# EAGLE design intrinsicLED (EAGLE 9.6.2)
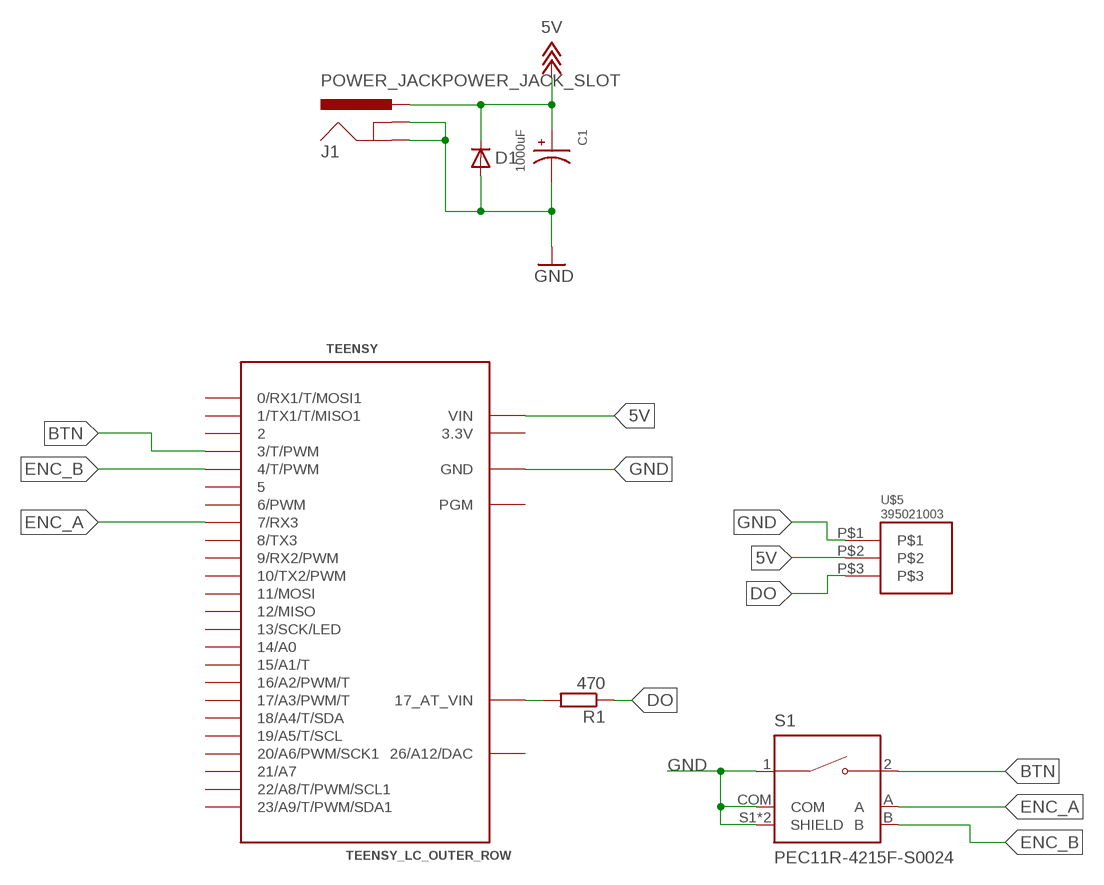
[diagram p0: schematic, sheet 1]

## Parts
C1  1000uF  16SVPF1000M  [CAP_16SVPF1000M]
D1  DIODE-DO214AA  [DO214AA]
J1  POWER_JACKPOWER_JACK_SLOT  [POWER_JACK_PTH_SLOT]
R1  470  R-EU_R1206  [R1206]
S1  PEC11R-4215F-S0024  [XDCR_PEC11R-4215F-S0024]
TEENSY  TEENSY_LC_OUTER_ROW  [TEENSY_3.0-3.2&LC_OUTER_ROW]
U$5  395021003  [395021003]

## Nets
5V: C1.1 D1.C J1.PWR TEENSY.VIN U$5.P$2 ; supply symbol labelled +18V
BTN: S1.2 TEENSY.3(3/T/PWM)
DO: R1.1 U$5.P$3
ENC_A: S1.A TEENSY.7(7/RX3)
ENC_B: S1.B TEENSY.4(4/T/PWM)
GND: C1.2 D1.A J1.GND J1.GNDBREAK S1.1 S1.COM S1.S1(SHIELD) S1.S2(SHIELD) TEENSY.AGND(GND) TEENSY.GND TEENSY.GND1(GND) U$5.P$1
N$1: R1.2 TEENSY.VBAT(17_AT_VIN)
Unconnected: TEENSY.0(0/RX1/T/MOSI1) TEENSY.1(1/TX1/T/MISO1) TEENSY.2 TEENSY.5 TEENSY.6(6/PWM) TEENSY.8(8/TX3) TEENSY.9(9/RX2/PWM) TEENSY.10(10/TX2/PWM) TEENSY.11(11/MOSI) TEENSY.12(12/MISO) TEENSY.13(13/SCK/LED) TEENSY.14/A0 TEENSY.15/A1(15/A1/T) TEENSY.16/A2(16/A2/PWM/T) TEENSY.17/A3(17/A3/PWM/T) TEENSY.18/A4(18/A4/T/SDA) TEENSY.19/A5(19/A5/T/SCL) TEENSY.20/A6(20/A6/PWM/SCK1) TEENSY.21/A7 TEENSY.22/A8(22/A8/T/PWM/SCL1) TEENSY.23/A9(23/A9/T/PWM/SDA1) TEENSY.PGM

## Power pins joined to a net without a drawn wire
3.3V: TEENSY.3.3V TEENSY.3.3V1(3.3V)
26/A12/DAC: TEENSY.RESET/DAC(26/A12/DAC)

## Library data of the parts
C1 = 16SVPF1000M:16SVPF1000M; DESCRIPTION: 1000F 16V Aluminum - Polymer Capacitors Radial, Can - SMD 12mOhm 5000 Hrs @ 105C; DIGI-KEY_PART_NUMBER: P16478TR-ND; MF: Panasonic; MP: 16SVPF1000M; PACKAGE: RADIAL-2 Panasonic; PURCHASE-URL: https://pricing.snapeda.com/search/part/16SVPF1000M/?ref=eda
D1 = diode:DIODE-: DIODE
J1 = SparkFun-Connectors:POWER_JACK: Power Jack Connector This is the standard 5.5mm barrel jack for power. The PTH is the most common, proven, reliable, footprint. The Slot footprint only works if the mill layer is transmitted to the PCB fab house so be warned. Here are the connectors we sell at SparkFun: DC Barrel Power Jack/Connector <https://www.sparkfun.com/products/119> (PRT-00119) DC Barrel Power Jack/Connector (SMD) <https://www.sparkfun.com/products/12748> (PRT-12748) DC Barrel Jack Adapter - Breadboard Compatible <https://www.sparkfun.com/products/10811> (PRT-10811) It is used on this SparkFun product (and many, many others): SparkFun RedBoard - Programmed with Arduino <https://www.sparkfun.com/products/12757> (DEV-12757) Also, if you need a mating power supply or connector, please check these out: Wall Adapter Power Supply - 9VDC 650mA <https://www.sparkfun.com/products/298> (TOL-00298) DC Barrel Jack Adapter - Male <https://www.sparkfun.com/products/10287> (PRT-10287); PROD_ID: CONN-08197
R1 = rcl:R-EU_: RESISTOR, European symbol; SPICEPREFIX: R
S1 = PEC11R-4215F-S0024:PEC11R-4215F-S0024: Incremental Encoder, 12 Mm, Contact Rating 10 Ma - 5 Vdc Check availability <https://pricing.snapeda.com/parts/PEC11R-4215F-S0024/Bourns/view-part?ref=eda>; AVAILABILITY: In Stock; DESCRIPTION: Rotary Encoder Mechanical 24 Quadrature (Incremental) Vertical; MF: Bourns; MP: PEC11R-4215F-S0024; PACKAGE: None; PRICE: None; PURCHASE-URL: https://pricing.snapeda.com/search/part/PEC11R-4215F-S0024/?ref=eda
TEENSY = Teensy_3_and_LC_Series_Boards_v1.4:TEENSY_LC_OUTER_ROW: Teensy LC with only outer row of pins.
U$5 = molex:395021003

## Board
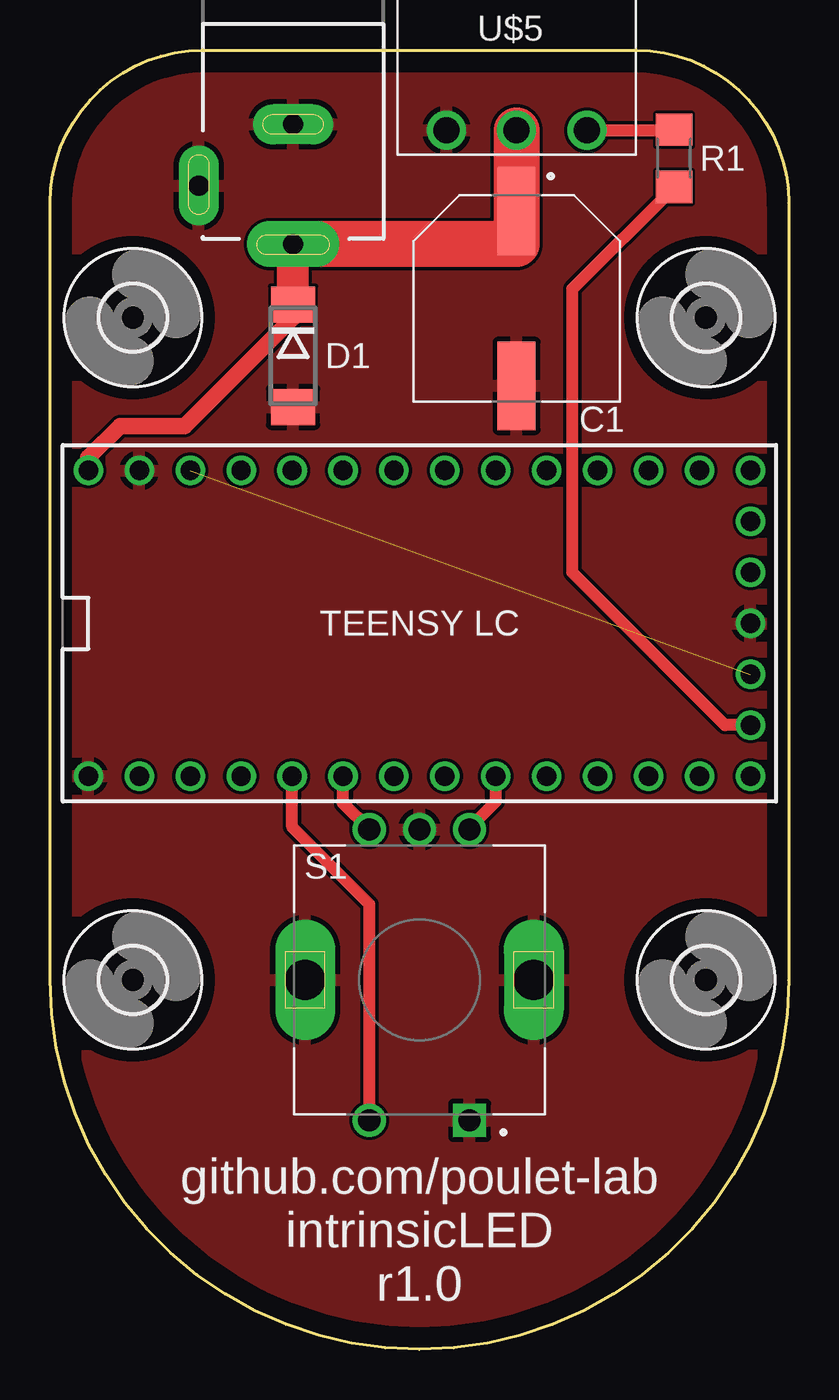
[diagram p1: board, top side]
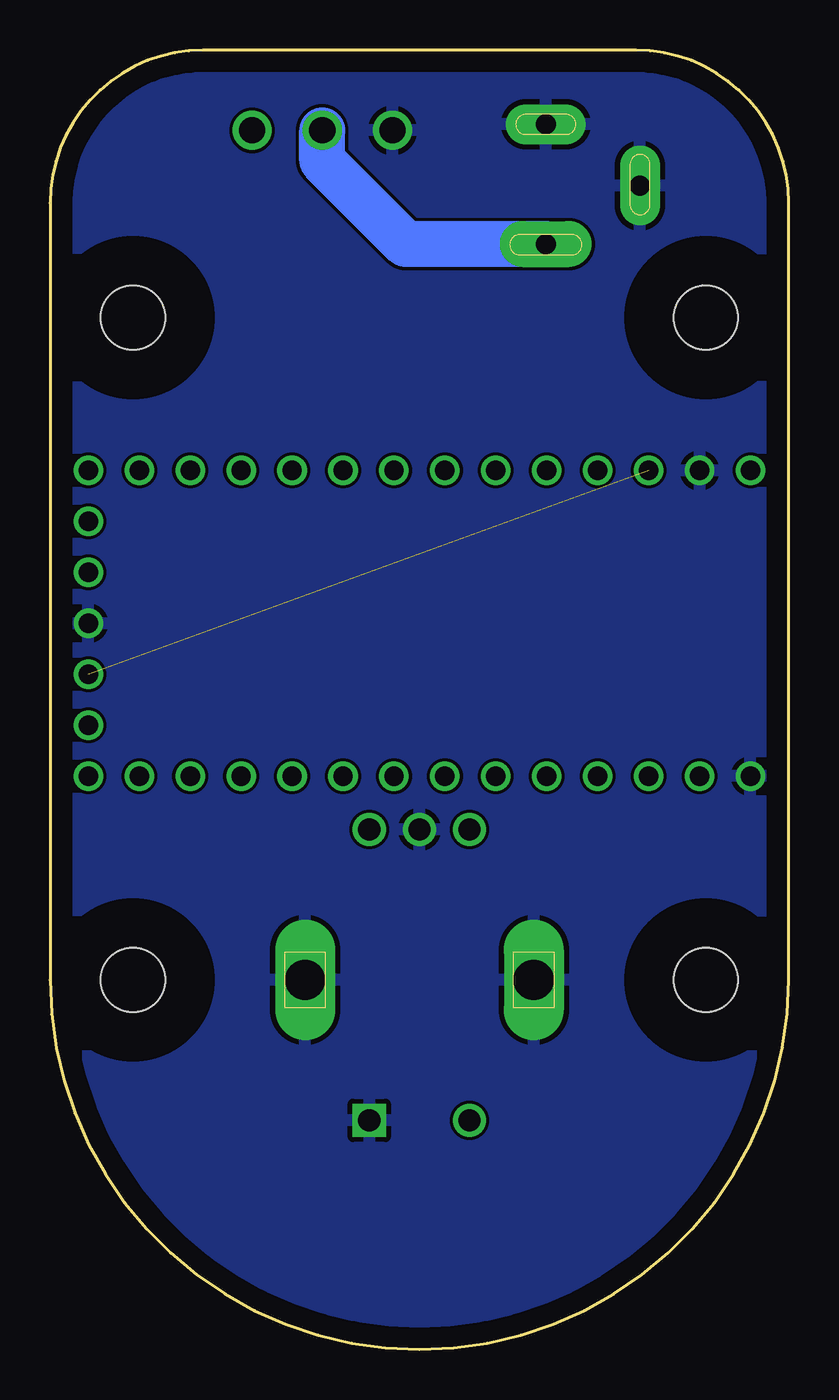
[diagram p2: board, bottom side, seen from below]

Size 36.83 x 64.77 mm. Coordinates in mm from the lower left corner, seen from the top.
Outline: 0,18.41 0,57.15 arc-90 7.62,64.77 29.21,64.77 arc-90 36.83,57.15 36.83,18.41 arc-90 18.41,0 arc-90 0,18.41
Copper layers (1*16): Top 0.035mm / dielectric 1.5mm / Bottom 0.035mm
Design rules "default": minimum track width 6mil, minimum drill 0.35mm, track to track 6mil, track to pad 6mil, pad to pad 6mil, via to via 6mil, smd to smd 6mil, copper to edge 40mil, drill to drill 6mil, minimum pad ring 10mil, minimum via ring 8mil, stop-mask expansion 4mil, vias tented up to drill 0mil, thermal gap 10mil

### Footprints (pad centres in the part's own frame; a part is rotated, then mirrored left to right if it is on the bottom)
CAP_16SVPF1000M = smd 4.4 x 1.9: 1 -4.35,0; 2 4.35,0
DO214AA = smd 1.8 x 2.2: A 2.55,0; C -2.55,0
POWER_JACK_PTH_SLOT = drill 1 pad 2 long: GND 0,0; GNDBREAK -3.048,4.699 | drill 1 pad 2.3 long: PWR -5.969,0
R1206 = smd 1.6 x 1.803: 1 -1.422,0; 2 1.422,0
XDCR_PEC11R-4215F-S0024 = drill 1.1 square: 1 -2.5,7 | drill 1.1: 2 2.5,7; A -2.5,-7.5; B 2.5,-7.5; COM 0,-7.5 | drill 2 long: S1 -5.7,0; S2 5.7,0
TEENSY_3.0-3.2&LC_OUTER_ROW = drill 0.965: 0 -7.62,13.97; 1 -7.62,11.43; 2 -7.62,8.89; 3 -7.62,6.35; 3.3V 7.62,11.43; 3.3V1 -2.54,-16.51; 4 -7.62,3.81; 5 -7.62,1.27; 6 -7.62,-1.27; 7 -7.62,-3.81; 8 -7.62,-6.35; 9 -7.62,-8.89; 10 -7.62,-11.43; 11 -7.62,-13.97; 12 -7.62,-16.51; 13 7.62,-16.51; 14/A0 7.62,-13.97; 15/A1 7.62,-11.43; 16/A2 7.62,-8.89; 17/A3 7.62,-6.35; 18/A4 7.62,-3.81; 19/A5 7.62,-1.27; 20/A6 7.62,1.27; 21/A7 7.62,3.81; 22/A8 7.62,6.35; 23/A9 7.62,8.89; AGND 7.62,13.97; GND -7.62,16.51; GND1 0,-16.51; PGM 2.54,-16.51; RESET/DAC 5.08,-16.51; VBAT -5.08,-16.51; VIN 7.62,16.51
3,2 = hole 3.2: 0,0
395021003 = drill 1.3: P$1 -3.5,0; P$2 0,0; P$3 3.5,0

### Placement (x,y rotation side)
C1  23.26,52.39 270 top
D1  12.12,49.53 270 top
J1  12.12,61.07 90 top
R1  31.11,59.37 270 top
S1  18.41,18.41 180 top
TEENSY  18.41,36.2 90 top
U$1  [3,2]  4.13,51.44 0 top
U$2  [3,2]  32.7,51.44 0 top
U$3  [3,2]  4.13,18.41 0 top
U$4  [3,2]  32.7,18.41 0 top
U$5  23.26,60.77 0 top

### Tracks (layer width: path | path; a pad name or v marks a point on that pad's centre or on a via)
3.3V  (1 unrouted)
5V
  Top 0.813: J1.PWR 11.44,54.37 | TEENSY.VIN 1.91,44.45 3.49,46.04 6.71,46.04 12.12,51.45 D1.C
  Top 1.6: D1.C J1.PWR
  Top 2.3: U$5.P$2 C1.1 23.26,55.1 J1.PWR
  Bottom 2.3: J1.PWR 19.1,55.1 23.26,59.26 U$5.P$2
BTN
  Top 0.61: TEENSY.3 12.06,26.04 15.91,22.18 S1.2
DO
  Top 0.61: U$5.P$3 31.14,60.77 R1.1
ENC_A
  Top 0.61: S1.A 20.91,26 22.23,27.3 TEENSY.7
ENC_B
  Top 0.61: 15.88,25.95 S1.B 14.61,27.23 TEENSY.4
GND
  pour Top: 0,0 0,64.77 36.83,64.77 36.83,0
  pour Bottom: 0,0 36.83,0 36.83,64.77 0,64.77
N$1
  Top 0.61: TEENSY.VBAT 33.66,31.11 26.04,38.73 26.04,52.87 R1.2

### Text on the board
tPlace: TEENSY LC | github.com/poulet-lab / intrinsicLED / r1.0